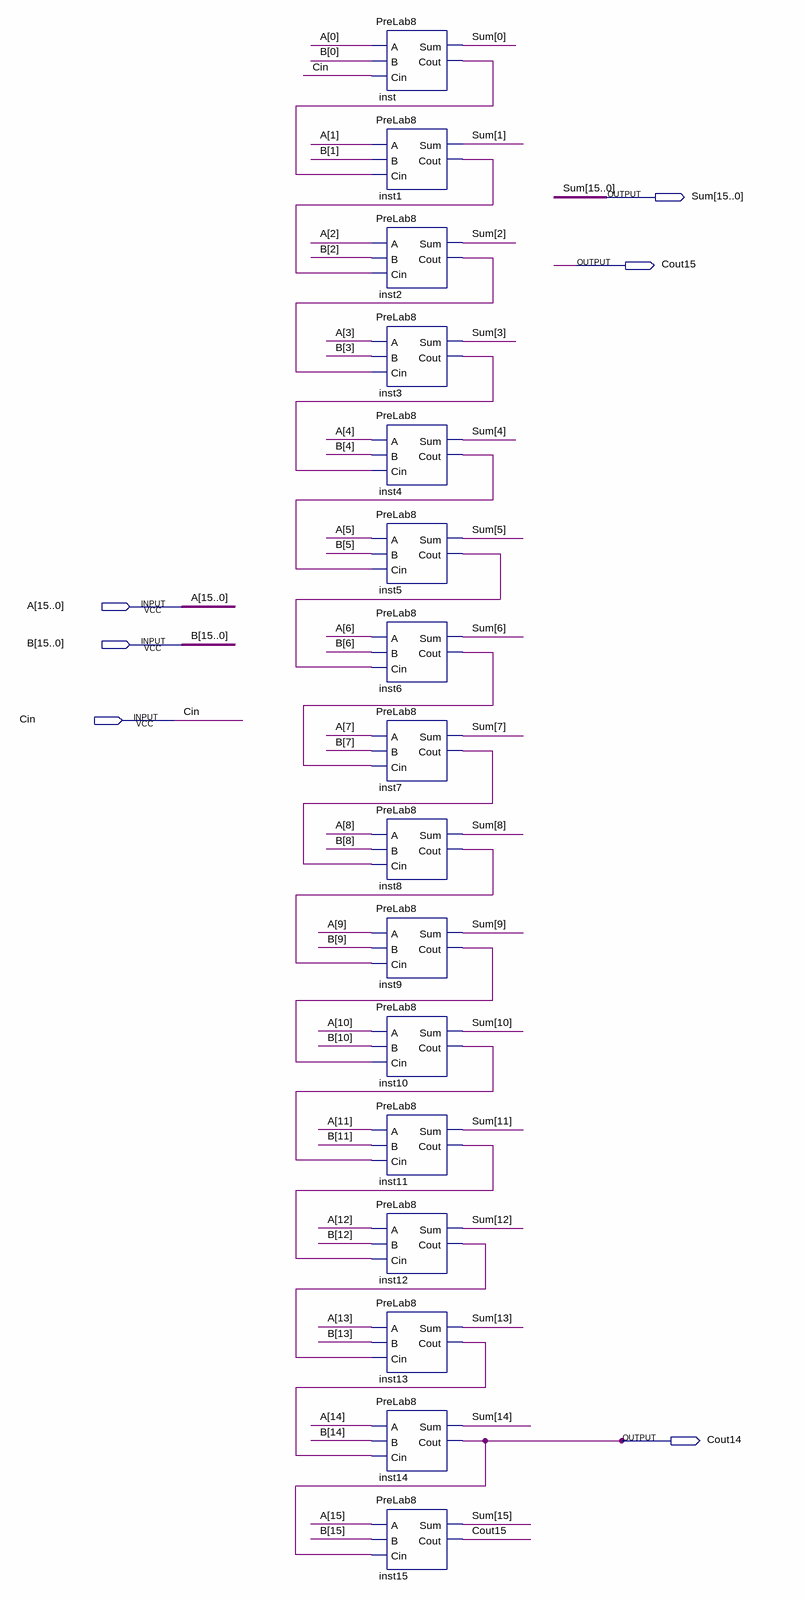
[diagram p0: schematic sheet]
// Quartus schematic FourBitAdder.bdf as structural Verilog: 16 symbols, 6 pins
module FourBitAdder (
  input  [15:0] A,
  input  [15:0] B,
  input  Cin,
  output [15:0] Sum,
  output Cout15,
  output Cout14
);

  wire inst1_cout, inst2_cout, inst3_cout, inst4_cout, inst5_cout, inst6_cout, inst7_cout, inst8_cout,
       inst9_cout, inst10_cout, inst11_cout, inst12_cout, inst13_cout, inst_cout;

  PreLab8 inst (.A(A[0]), .B(B[0]), .Cin(Cin), .Sum(Sum[0]), .Cout(inst_cout));
  PreLab8 inst1 (.A(A[1]), .B(B[1]), .Cin(inst_cout), .Sum(Sum[1]), .Cout(inst1_cout));
  PreLab8 inst2 (.A(A[2]), .B(B[2]), .Cin(inst1_cout), .Sum(Sum[2]), .Cout(inst2_cout));
  PreLab8 inst3 (.A(A[3]), .B(B[3]), .Cin(inst2_cout), .Sum(Sum[3]), .Cout(inst3_cout));
  PreLab8 inst4 (.A(A[4]), .B(B[4]), .Cin(inst3_cout), .Sum(Sum[4]), .Cout(inst4_cout));
  PreLab8 inst5 (.A(A[5]), .B(B[5]), .Cin(inst4_cout), .Sum(Sum[5]), .Cout(inst5_cout));
  PreLab8 inst6 (.A(A[6]), .B(B[6]), .Cin(inst5_cout), .Sum(Sum[6]), .Cout(inst6_cout));
  PreLab8 inst7 (.A(A[7]), .B(B[7]), .Cin(inst6_cout), .Sum(Sum[7]), .Cout(inst7_cout));
  PreLab8 inst8 (.A(A[8]), .B(B[8]), .Cin(inst7_cout), .Sum(Sum[8]), .Cout(inst8_cout));
  PreLab8 inst9 (.A(A[9]), .B(B[9]), .Cin(inst8_cout), .Sum(Sum[9]), .Cout(inst9_cout));
  PreLab8 inst10 (.A(A[10]), .B(B[10]), .Cin(inst9_cout), .Sum(Sum[10]), .Cout(inst10_cout));
  PreLab8 inst11 (.A(A[11]), .B(B[11]), .Cin(inst10_cout), .Sum(Sum[11]), .Cout(inst11_cout));
  PreLab8 inst12 (.A(A[12]), .B(B[12]), .Cin(inst11_cout), .Sum(Sum[12]), .Cout(inst12_cout));
  PreLab8 inst13 (.A(A[13]), .B(B[13]), .Cin(inst12_cout), .Sum(Sum[13]), .Cout(inst13_cout));
  PreLab8 inst14 (.A(A[14]), .B(B[14]), .Cin(inst13_cout), .Sum(Sum[14]), .Cout(Cout14));
  PreLab8 inst15 (.A(A[15]), .B(B[15]), .Cin(Cout14), .Sum(Sum[15]), .Cout(Cout15));
endmodule
